# EAGLE design mainboard (EAGLE 6.5.0)
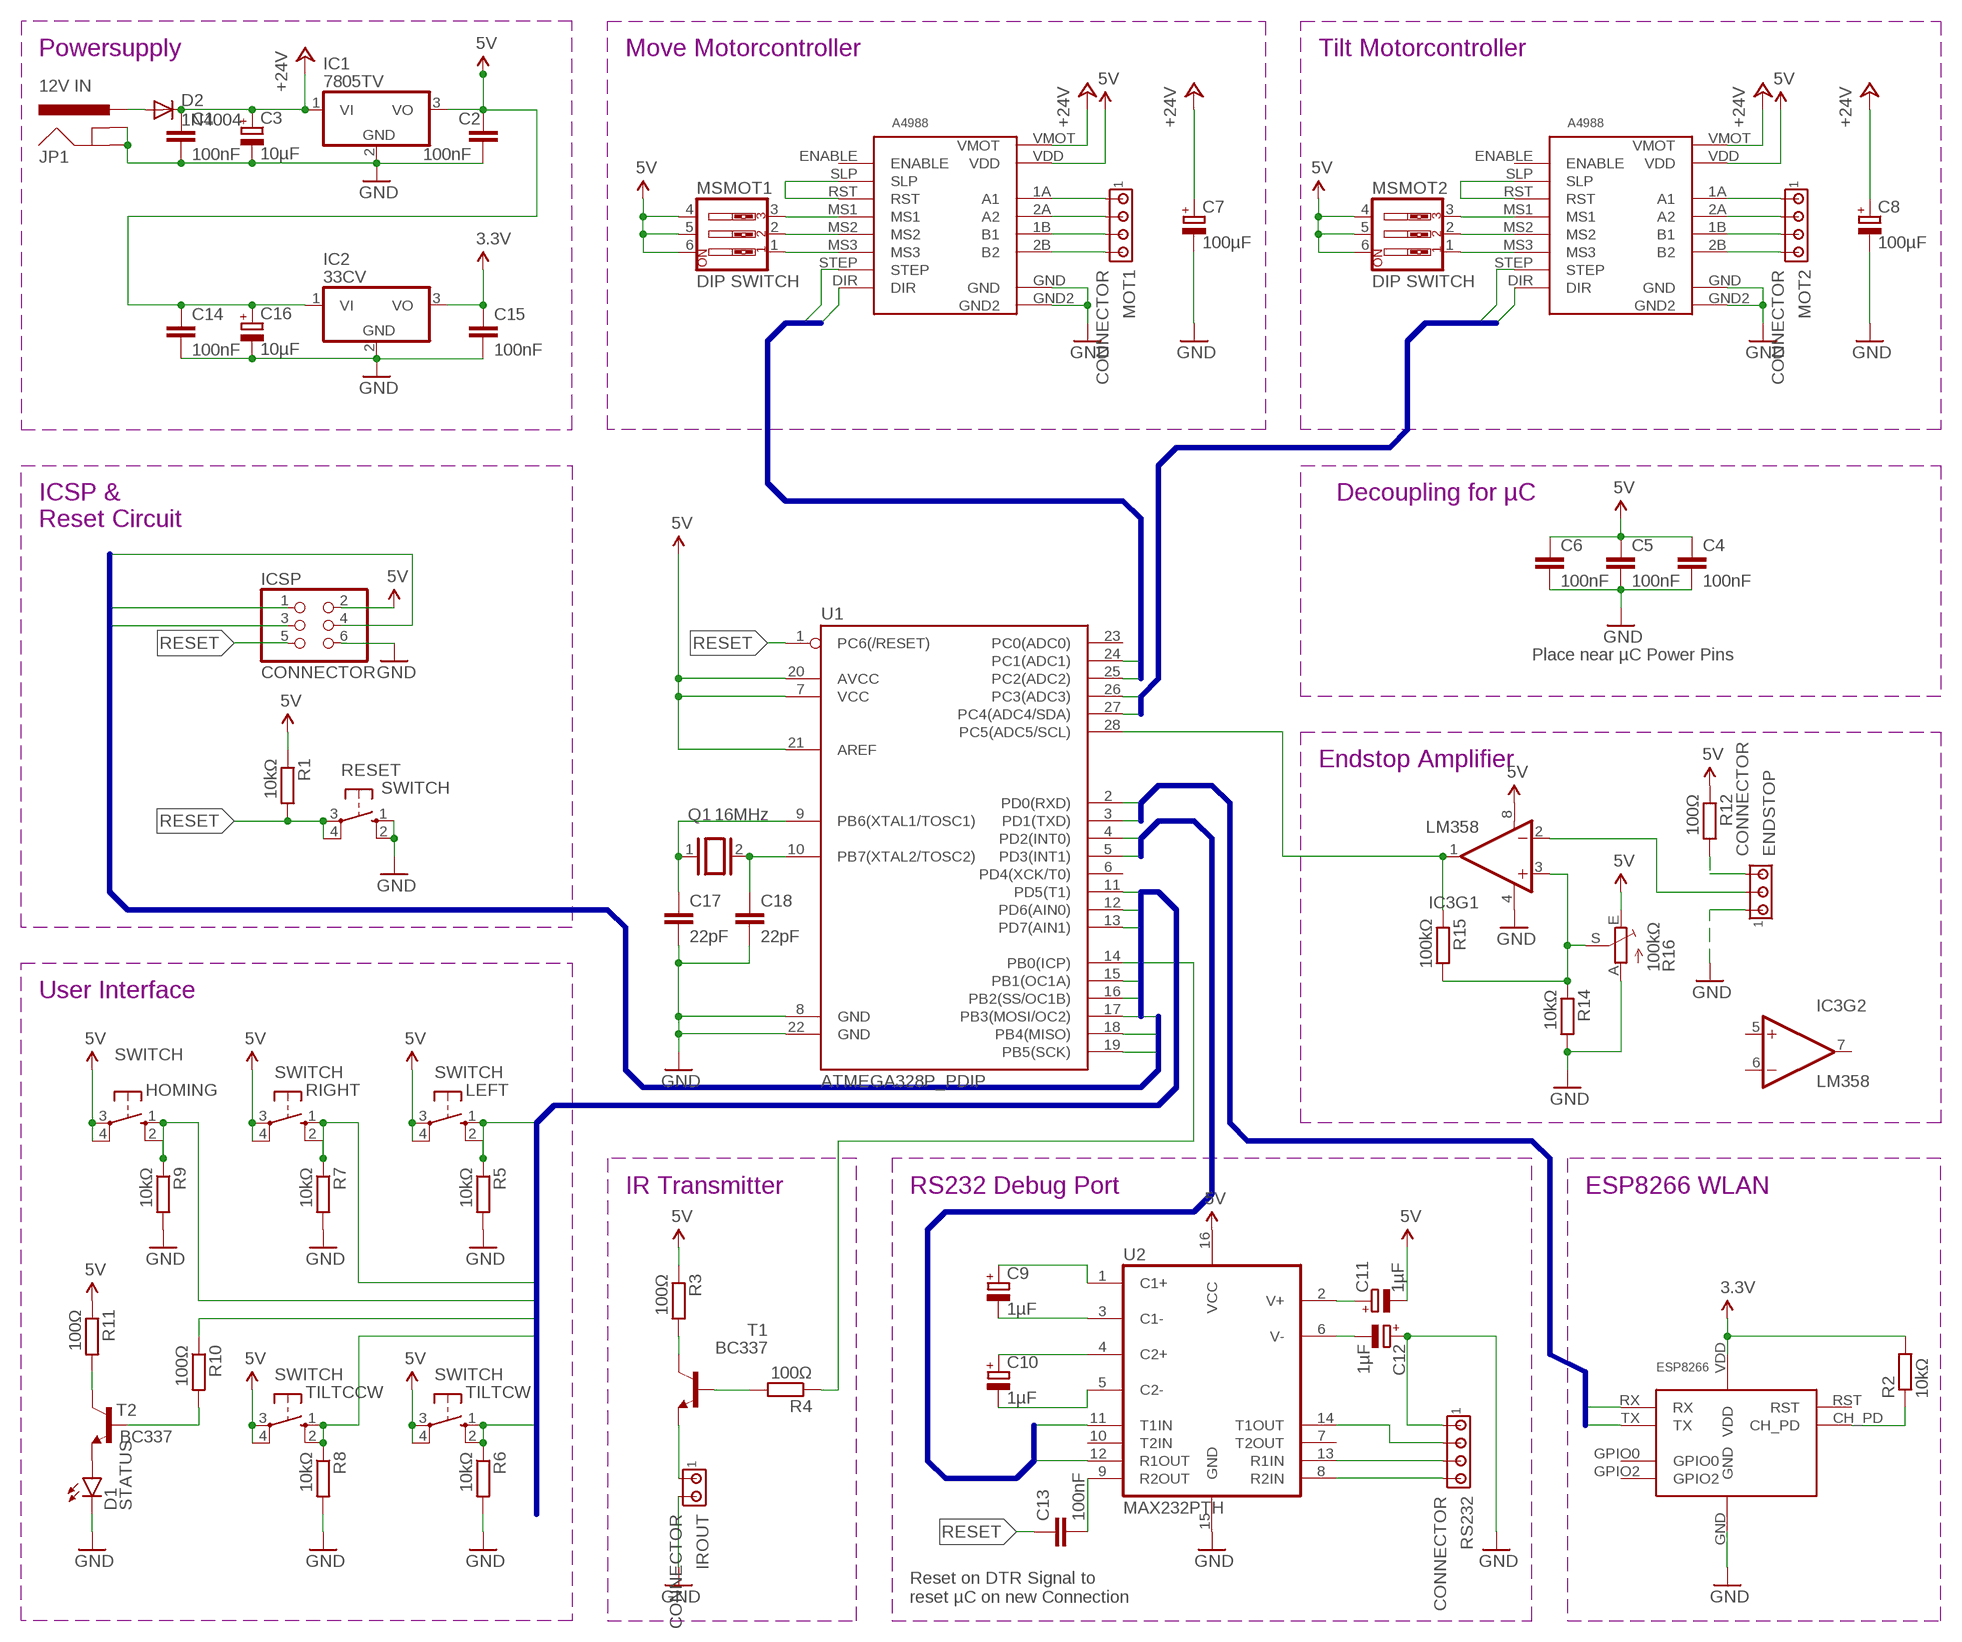
[diagram p0: schematic, sheet 1]

## Parts
C1  100nF  C-EU050-024X044  [C050-024X044]
C2  100nF  C-EU050-024X044  [C050-024X044]
C3  10µF  CPOL-EUE2,5-6E  [E2,5-6E]
C4  100nF  C-EU050-024X044  [C050-024X044]
C5  100nF  C-EU050-024X044  [C050-024X044]
C6  100nF  C-EU050-024X044  [C050-024X044]
C7  100µF  CPOL-EUE2,5-6E  [E2,5-6E]
C8  100µF  CPOL-EUE2,5-6E  [E2,5-6E]
C9  1µF  CPOL-EUE2,5-6E  [E2,5-6E]
C10  1µF  CPOL-EUE2,5-6E  [E2,5-6E]
C11  1µF  CPOL-EUE2,5-6E  [E2,5-6E]
C12  1µF  CPOL-EUE2,5-6E  [E2,5-6E]
C13  100nF  C-EU050-024X044  [C050-024X044]
C14  100nF  C-EU050-024X044  [C050-024X044]
C15  100nF  C-EU050-024X044  [C050-024X044]
C16  10µF  CPOL-EUE2,5-6E  [E2,5-6E]
C17  22pF  C-EU050-024X044  [C050-024X044]
C18  22pF  C-EU050-024X044  [C050-024X044]
D1  STATUS  LED5MM  [LED5MM]
D2  1N4004  [DO41-10]
ENDSTOP  CONNECTOR  MTA03-100  [10X03MTA]
HOMING  SWITCH  10-XX  [B3F-10XX]
IC1  7805TV  [TO220V]
IC2  33CV  7805TV  [TO220V]
IC3  LM358  [DIP08]
ICSP  CONNECTOR  PINHD-2X3  [2X03]
IROUT  CONNECTOR  MTA02-100  [10X02MTA]
JP1  12V IN  POWER_JACKSLT  [POWER_JACK_SLOT]
LEFT  SWITCH  10-XX  [B3F-10XX]
MOT1  CONNECTOR  MTA04-100  [10X04MTA]
MOT2  CONNECTOR  MTA04-100  [10X04MTA]
MSMOT1  DIP SWITCH  SW_DIP-3  [EDG-03]
MSMOT2  DIP SWITCH  SW_DIP-3  [EDG-03]
Q1  16MHz  XTAL/S  [QS]
R1  10kΩ  R-EU_0207/7  [0207/7]
R2  10kΩ  R-EU_0207/7  [0207/7]
R3  100Ω  R-EU_0207/7  [0207/7]
R4  100Ω  R-EU_0207/7  [0207/7]
R5  10kΩ  R-EU_0207/7  [0207/7]
R6  10kΩ  R-EU_0207/7  [0207/7]
R7  10kΩ  R-EU_0207/7  [0207/7]
R8  10kΩ  R-EU_0207/7  [0207/7]
R9  10kΩ  R-EU_0207/7  [0207/7]
R10  100Ω  R-EU_0207/7  [0207/7]
R11  100Ω  R-EU_0207/7  [0207/7]
R12  100Ω  R-EU_0207/7  [0207/7]
R14  10kΩ  R-EU_0207/7  [0207/7]
R15  100kΩ  R-EU_0207/7  [0207/7]
R16  100kΩ  TRIM_EU-CA9V  [CA9V]
RESET  SWITCH  10-XX  [B3F-10XX]
RIGHT  SWITCH  10-XX  [B3F-10XX]
RS232  CONNECTOR  MTA04-100  [10X04MTA]
T1  BC337  [TO92]
T2  BC337  [TO92]
TILTCCW  SWITCH  10-XX  [B3F-10XX]
TILTCW  SWITCH  10-XX  [B3F-10XX]
U1  ATMEGA328P_PDIP  [DIL28-3]
U2  MAX232PTH  [DIL16]
U3  A4988  [A4988]
U4  A4988  [A4988]
U5  ESP8266  [ESP8266]

## Nets
3.3V: C15.1 IC2.3(VO) R2.2 U5.VDD
5V: C2.1 C4.1 C5.1 C6.1 C11.- C14.1 C16.+ HOMING.3(P) HOMING.4(P1) IC1.3(VO) IC2.1(VI) IC3.8(V+) ICSP.2 LEFT.3(P) LEFT.4(P1) MSMOT1.4 MSMOT1.5 MSMOT1.6 MSMOT2.4 MSMOT2.5 MSMOT2.6 R1.1 R3.1 R11.1 R12.1 R16.E RIGHT.3(P) RIGHT.4(P1) TILTCCW.3(P) TILTCCW.4(P1) TILTCW.3(P) TILTCW.4(P1) U1.7(VCC) U1.20(AVCC) U1.21(AREF) U2.16(VCC) U3.VDD U4.VDD
+24V: C1.1 C3.+ C7.+ C8.+ D2.C IC1.1(VI) U3.VMOT U4.VMOT
DIR1: U1.24(PC1(ADC1)) U3.DIR
DIR2: U1.26(PC3(ADC3)) U4.DIR
ESPRX: U1.3(PD1(TXD)) U5.RX
ESPTX: U1.2(PD0(RXD)) U5.TX
GND: C1.2 C2.2 C3.- C4.2 C5.2 C6.2 C7.- C8.- C12.+ C14.2 C15.2 C16.- C17.2 C18.2 D1.K(C) ENDSTOP.1 IC1.2(GND) IC2.2(GND) IC3.4(V-) ICSP.6 IROUT.2 JP1.GND@1(GNDBREAK) JP1.GND@2(GND) R5.2 R6.2 R7.2 R8.2 R9.2 R14.2 R16.A RESET.1(S) RESET.2(S1) RS232.1 U1.8(GND) U1.22(GND) U2.15(GND) U3.GND U3.GND2 U4.GND U4.GND2 U5.GND
HOMING: HOMING.1(S) HOMING.2(S1) ICSP.4 R9.1 U1.17(PB3(MOSI/OC2))
LEFT: LEFT.1(S) LEFT.2(S1) R5.1 U1.11(PD5(T1))
MISO: ICSP.1 U1.18(PB4(MISO))
N$1: U3.RST U3.SLP
N$2: MOT1.1 U3.1A(A1)
N$3: MOT1.2 U3.2A(A2)
N$4: MOT1.3 U3.1B(B1)
N$5: MOT1.4 U3.2B(B2)
N$6: MSMOT1.1 U3.MS3
N$7: MSMOT1.2 U3.MS2
N$8: MSMOT1.3 U3.MS1
N$9: U4.RST U4.SLP
N$10: C13.2 U2.9(R2OUT)
N$11: MSMOT2.1 U4.MS3
N$12: MSMOT2.2 U4.MS2
N$13: MSMOT2.3 U4.MS1
N$14: MOT2.1 U4.1A(A1)
N$15: MOT2.2 U4.2A(A2)
N$16: MOT2.3 U4.1B(B1)
N$17: MOT2.4 U4.2B(B2)
N$18: RS232.2 U2.14(T1OUT)
N$19: RS232.3 U2.13(R1IN)
N$20: C9.+ U2.1(C1+)
N$21: C9.- U2.3(C1-)
N$22: C10.+ U2.4(C2+)
N$23: C10.- U2.5(C2-)
N$24: C11.+ U2.2(V+)
N$25: C12.- U2.6(V-)
N$26: RS232.4 U2.8(R2IN)
N$27: R2.1 U5.CH_PD
N$28: R4.2 T1.2(B)
N$29: R3.2 T1.3(C)
N$30: IROUT.1 T1.1(E)
N$31: IC3.1(OUT) R15.1 U1.28(PC5(ADC5/SCL))
N$32: D1.A T2.1(E)
N$33: R10.2 T2.2(B)
N$34: R11.2 T2.3(C)
N$35: ENDSTOP.3 R12.2
N$36: ENDSTOP.2 IC3.2(-IN)
N$37: IC3.3(+IN) R14.1 R15.2 R16.S
N$38: R4.1 U1.14(PB0(ICP))
N$39: C18.1 Q1.2 U1.10(PB7(XTAL2/TOSC2))
N$40: C17.1 Q1.1 U1.9(PB6(XTAL1/TOSC1))
N$41: D2.A JP1.PWR
RESET: C13.1 ICSP.5 R1.2 RESET.3(P) RESET.4(P1) U1.1(PC6(/RESET))
RIGHT: R7.1 RIGHT.1(S) RIGHT.2(S1) U1.13(PD7(AIN1))
RXD: U1.4(PD2(INT0)) U2.12(R1OUT)
SCK: ICSP.3 U1.19(PB5(SCK))
STATUS: R10.1 U1.16(PB2(SS/OC1B))
STEP1: U1.25(PC2(ADC2)) U3.STEP
STEP2: U1.27(PC4(ADC4/SDA)) U4.STEP
TILTCCW: R8.1 TILTCCW.1(S) TILTCCW.2(S1) U1.12(PD6(AIN0))
TILTCW: R6.1 TILTCW.1(S) TILTCW.2(S1) U1.15(PB1(OC1A))
TXD: U1.5(PD3(INT1)) U2.11(T1IN)
Unconnected: IC3.5(+IN) IC3.6(-IN) IC3.7(OUT) U1.6(PD4(XCK/T0)) U1.23(PC0(ADC0)) U2.7(T2OUT) U2.10(T2IN) U3.ENABLE U4.ENABLE U5.GPIO0 U5.GPIO2 U5.RST

## Buses
STEP2,DIR2
RXD,TXD
HOMING,MISO,SCK
ESPTX,ESPRX
LEFT,RIGHT,TILTCW,TILTCCW,HOMING,STATUS
STEP1,DIR1

## Notes on the sheet
- Powersupply | Move Motorcontroller | Tilt Motorcontroller
- ICSP &
  Reset Circuit
- Decoupling for µC
- Place near µC Power Pins
- Endstop Amplifier
- User Interface
- IR Transmitter | RS232 Debug Port | ESP8266 WLAN
- Reset on DTR Signal to 
  reset µC on new Connection

## Library data of the parts
C1 C2 C4-C6 C13-C15 C17 C18 = rcl:C-EU: CAPACITOR, European symbol
C3 C7-C12 C16 = rcl:CPOL-EU: POLARIZED CAPACITOR, European symbol
D1 = SparkFun-LED:LED: LEDs Standard schematic elements and footprints for 5mm, 3mm, 1206, and 0603 sized LEDs. 5mm - Spark Fun Electronics SKU : COM-00529 (and others)
D2 = diode:1N4004: DIODE general purpose rectifier, 1 A
ENDSTOP = con-amp:MTA03-100: AMP connector
HOMING LEFT RESET RIGHT TILTCCW TILTCW = switch-omron:10-XX: OMRON SWITCH; MPN: B3F-1000; OC_FARNELL: 176432; OC_NEWARK: 36M3542
IC1 IC2 = linear:78*: Positive VOLTAGE REGULATOR Source: http://cache.national.com/ds/LM/LM78L05.pdf http://www.fairchildsemi.com/ds/LM/LM7805.pdf
IC3 = SparkFun-AnalogIC:LM358: Jellybean op-amp; PROD_ID: IC-09172
ICSP = SparkFun-Connectors:PINHD-2X3: PIN HEADER
IROUT = con-amp:MTA02-100: AMP connector
JP1 = SparkFun-Connectors:POWER_JACK: Power Jack This is the standard 5.5mm barrel jack for power. The PTH is the most common, proven, reliable, footprint. The Slot footprint only works if the mill layer is transmitted to the PCB fab house so be warned. Mating wall wart : TOL-00298 (and others); PROD_ID: PRT-00119
MOT1 MOT2 RS232 = con-amp:MTA04-100: AMP connector
MSMOT1 MSMOT2 = special:SW_DIP-3: DIP SWITCH
Q1 = special:XTAL/S: CRYSTAL
R1-R12 R14 R15 = rcl:R-EU_: RESISTOR, European symbol
R16 = pot:TRIM_EU-: POTENTIOMETER
T1 T2 = transistor:BC337: NPN TRANSISTOR
U1 = SparkFun-DigitalIC:ATMEGA328P_PDIP: uC used in the Arduino 32kb flash, 1k EEPROM, 2k SRAM This is the through-hole version of this chip.
U2 = SparkFun-DigitalIC:MAX232: RS232 Transceiver Very common IC. This is generically called 'MAX232', but works with the 3V equivalent MAX3232 generic ICs. Field tested and mother approved. Spark Fun Electronics SKU : COM-00316 (DIP) and COM-00589 (SMD)
U3 U4 = parts:A4988
U5 = parts:ESP8266

## Board
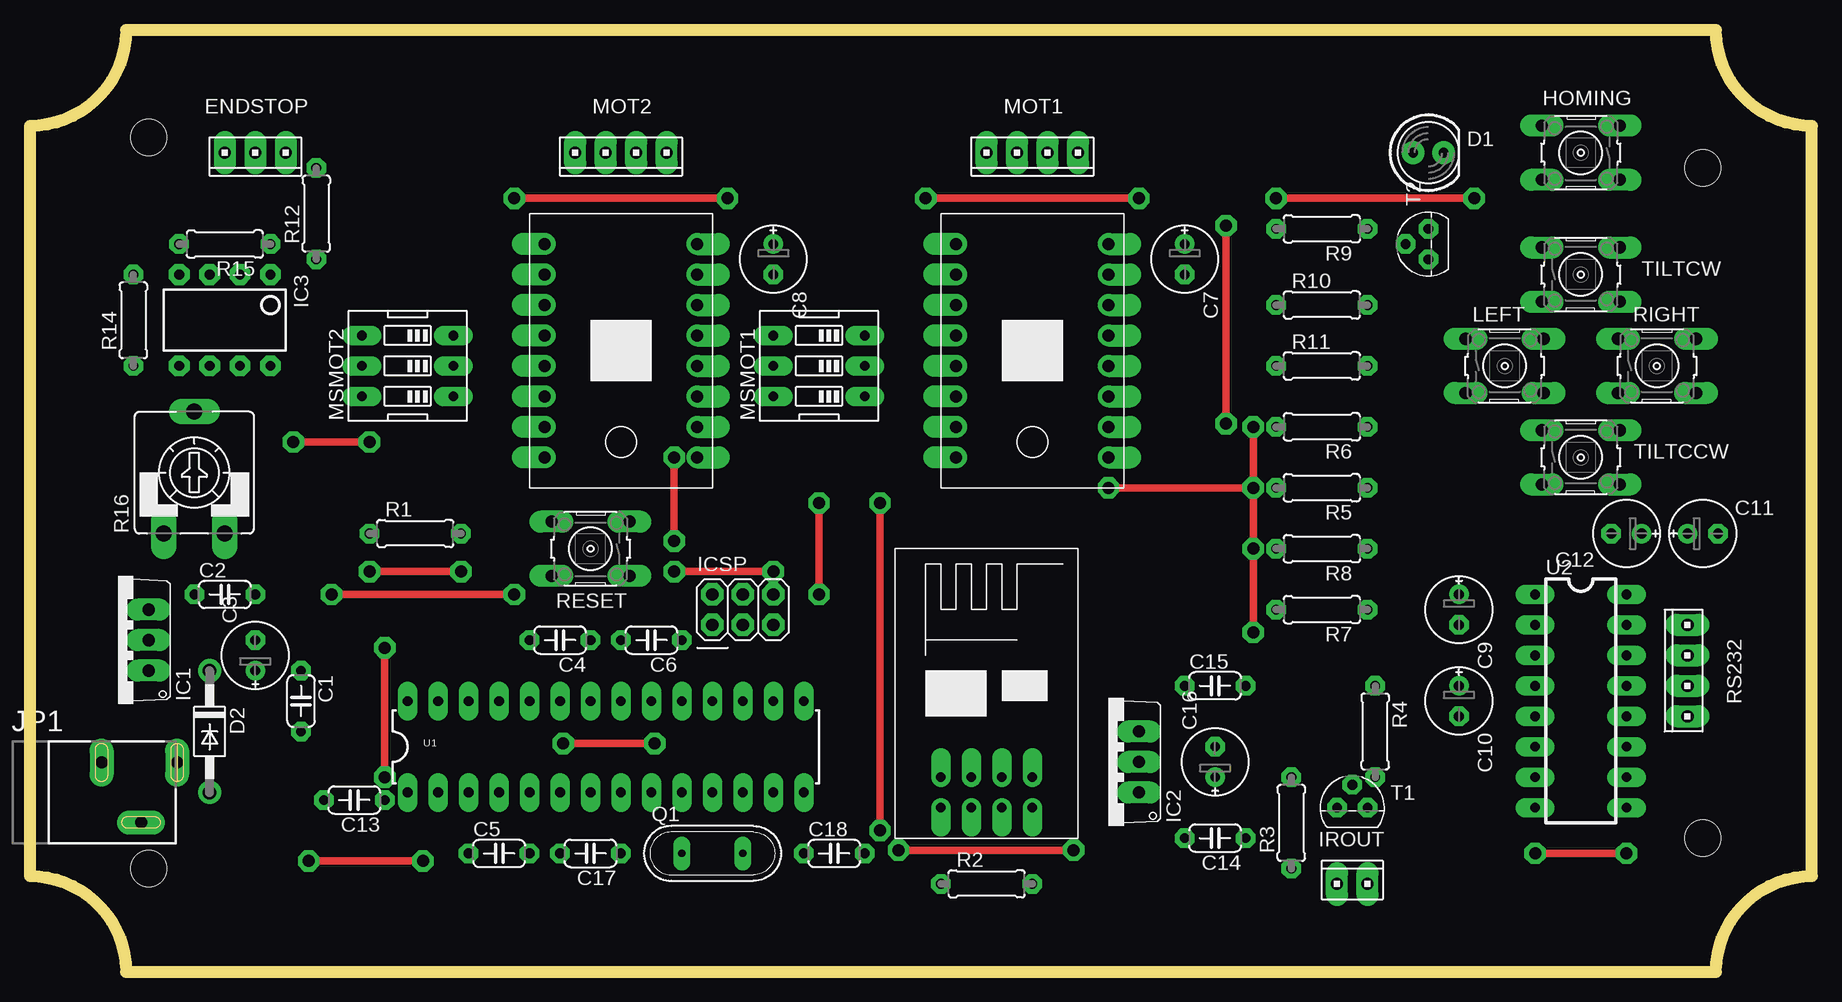
[diagram p1: board, top side]
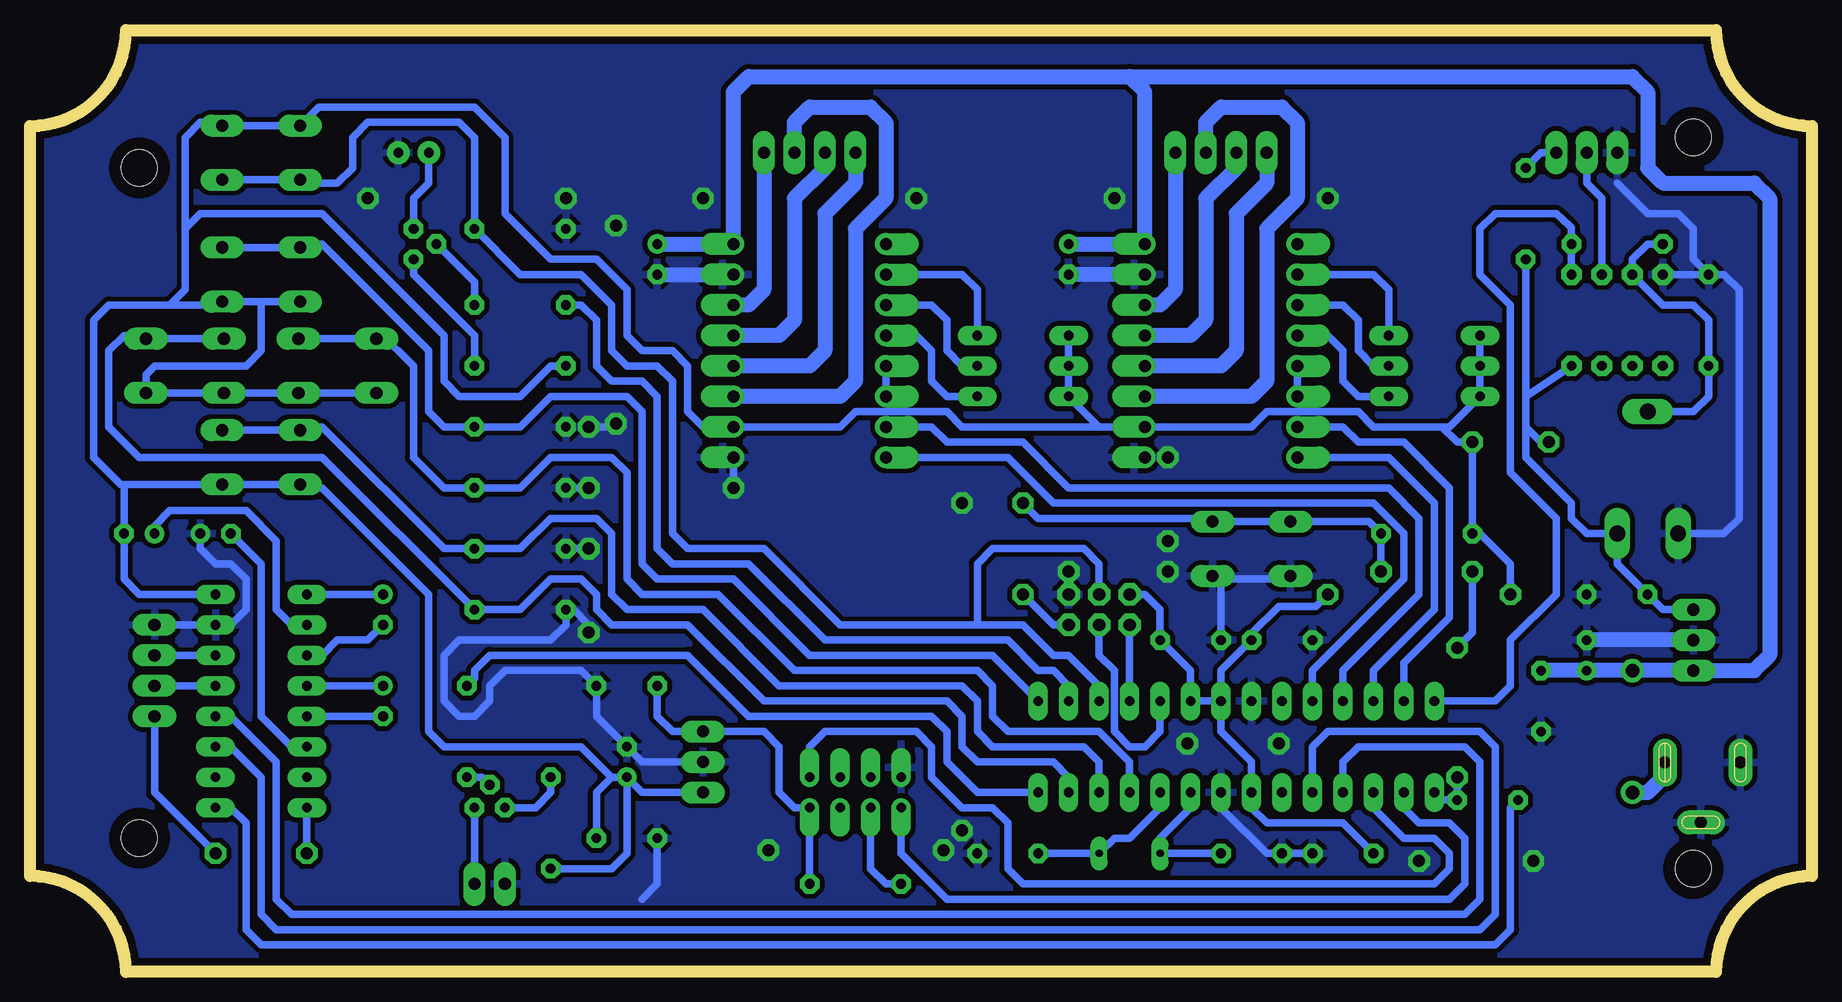
[diagram p2: board, bottom side, seen from below]

Size 148.54 x 78.54 mm. Coordinates in mm from the lower left corner, seen from the top.
Outline: 148.54,70.54 arc-90 140.54,78.54 8,78.54 arc-90 0,70.54 0,8 arc-90 8,0 140.54,0 arc-90 148.54,8 148.54,70.54
Copper layers (1*16): Top 0.035mm / dielectric 1.5mm / Bottom 0.035mm
Design rules "default *": minimum track width 10mil, minimum drill 24mil, track to track 8mil, track to pad 8mil, pad to pad 8mil, via to via 8mil, smd to smd 8mil, copper to edge 40mil, drill to drill 8mil, minimum pad ring 16mil, minimum via ring 8mil, stop-mask expansion 4mil, vias tented up to drill 0mil, thermal gap 16mil
Holes 3 mm at 139.43,67.04 139.43,11.16 9.89,8.62 9.89,69.58
Milling: 8 lines

### Footprints (pad centres in the part's own frame; a part is rotated, then mirrored left to right if it is on the bottom)
C050-024X044 = drill 0.813 octagon: 1 -2.54,0; 2 2.54,0
E2,5-6E = drill 0.813 pad 1.575: + -1.27,0 | drill 0.813 pad 1.575 octagon: - 1.27,0
LED5MM = drill 0.813 pad 1.88: A -1.27,0; K 1.27,0
DO41-10 = drill 1.118: A 5.08,0; C -5.08,0
10X03MTA = drill 1.016 long: 1 2.54,0; 2 0,0; 3 -2.54,0
B3F-10XX = drill 1.016 long: 1 -3.251,2.261; 2 3.251,2.261; 3 -3.251,-2.261; 4 3.251,-2.261
TO220V = drill 1.016 long: 1 -2.54,-2.54; 2 0,-2.54; 3 2.54,-2.54
DIP08 = drill 0.813 pad 1.727 octagon: 1 -3.81,-3.81; 2 -1.27,-3.81; 3 1.27,-3.81; 4 3.81,-3.81; 5 3.81,3.81; 6 1.27,3.81; 7 -1.27,3.81; 8 -3.81,3.81
2X03 = drill 1.016 pad 1.88 octagon: 1 -2.54,-1.27; 2 -2.54,1.27; 3 0,-1.27; 4 0,1.27; 5 2.54,-1.27; 6 2.54,1.27
10X02MTA = drill 1.016 long: 1 1.27,0; 2 -1.27,0
POWER_JACK_SLOT = drill 1 pad 2 long: GND@1 2.58,7.5; GND@2 7.58,10.8; PWR 2.58,13.8
10X04MTA = drill 1.016 long: 1 3.81,0; 2 1.27,0; 3 -1.27,0; 4 -3.81,0
EDG-03 = drill 0.813 long: 1 -2.54,-3.81; 2 0,-3.81; 3 2.54,-3.81; 4 2.54,3.81; 5 0,3.81; 6 -2.54,3.81
QS = drill 0.61 long: 1 -2.54,0; 2 2.54,0
0207/7 = drill 0.813 octagon: 1 -3.81,0; 2 3.81,0
CA9V = drill 1.321 long: A -2.54,-5.08; E 2.54,-5.08; S 0,5.08
TO92 = drill 0.813 octagon: 1 1.27,0; 2 0,1.905; 3 -1.27,0
DIL28-3 = drill 0.813 long: 1 -16.51,-3.81; 2 -13.97,-3.81; 3 -11.43,-3.81; 4 -8.89,-3.81; 5 -6.35,-3.81; 6 -3.81,-3.81; 7 -1.27,-3.81; 8 1.27,-3.81; 9 3.81,-3.81; 10 6.35,-3.81; 11 8.89,-3.81; 12 11.43,-3.81; 13 13.97,-3.81; 14 16.51,-3.81; 15 16.51,3.81; 16 13.97,3.81; 17 11.43,3.81; 18 8.89,3.81; 19 6.35,3.81; 20 3.81,3.81; 21 1.27,3.81; 22 -1.27,3.81; 23 -3.81,3.81; 24 -6.35,3.81; 25 -8.89,3.81; 26 -11.43,3.81; 27 -13.97,3.81; 28 -16.51,3.81
DIL16 = drill 0.813 long: 1 -8.89,-3.81; 2 -6.35,-3.81; 3 -3.81,-3.81; 4 -1.27,-3.81; 5 1.27,-3.81; 6 3.81,-3.81; 7 6.35,-3.81; 8 8.89,-3.81; 9 8.89,3.81; 10 6.35,3.81; 11 3.81,3.81; 12 1.27,3.81; 13 -1.27,3.81; 14 -3.81,3.81; 15 -6.35,3.81; 16 -8.89,3.81
A4988 = drill 1 offset: 1A 6.35,-1.27; 1B 6.35,-3.81; 2A 6.35,1.27; 2B 6.35,3.81; DIR -6.35,-8.89; ENABLE -6.35,8.89; GND 6.35,6.35; GND2 6.35,-8.89; MS1 -6.35,6.35; MS2 -6.35,3.81; MS3 -6.35,1.27; RST -6.35,-1.27; SLP -6.35,-3.81; STEP -6.35,-6.35; VDD 6.35,-6.35; VMOT 6.35,8.89
ESP8266 = drill 0.8 offset: CH_PD -1.27,-3.81; GND -3.81,-1.27; GPIO0 1.27,-1.27; GPIO2 -1.27,-1.27; RST 1.27,-3.81; RX 3.81,-1.27; TX -3.81,-3.81; VDD 3.81,-3.81

### Placement (x,y rotation side)
C1  22.59,22.59 270 top
C2  16.24,31.48 0 top
C3  18.78,26.4 90 top
C4  44.18,27.67 180 top
C5  39.1,9.89 0 top
C6  51.8,27.67 180 top
C7  96.25,59.42 270 top
C8  61.96,59.42 270 top
C9  119.11,30.21 270 top
C10  119.11,22.59 270 top
C11  139.43,36.56 0 top
C12  133.08,36.56 180 top
C13  27.04,14.33 180 top
C14  98.79,11.16 180 top
C15  98.79,23.86 0 top
C16  98.79,17.51 90 top
C17  46.72,9.89 180 top
C18  67.04,9.89 0 top
D1  116.57,68.31 0 top
D2  14.97,20.05 270 top
ENDSTOP  18.78,68.31 180 top
HOMING  129.27,68.31 180 top
IC1  7.35,27.67 90 top
IC2  89.9,17.51 90 top
IC3  16.24,54.34 180 top
ICSP  59.42,30.21 0 top
IROUT  110.22,7.35 0 top
JP1  -1.54,20.05 270 top
LEFT  122.92,50.53 0 top
MOT1  83.55,68.31 180 top
MOT2  49.26,68.31 180 top
MSMOT1  65.77,50.53 90 top
MSMOT2  31.48,50.53 90 top
Q1  56.88,9.89 0 top
R1  32.12,36.56 0 top
R2  79.74,7.35 0 top
R3  105.14,12.43 90 top
R4  112.12,20.05 270 top
R5  107.68,40.37 180 top
R6  107.68,45.45 180 top
R7  107.68,30.21 180 top
R8  107.68,35.29 180 top
R9  107.68,61.96 180 top
R10  107.68,55.61 0 top
R11  107.68,50.53 0 top
R12  23.86,63.23 90 top
R14  8.62,54.34 90 top
R15  16.24,60.69 180 top
R16  13.7,41.64 0 top
RESET  46.72,35.29 180 top
RIGHT  135.62,50.53 0 top
RS232  138.16,25.13 90 top
T1  110.22,13.7 0 top
T2  116.57,60.69 90 top
TILTCCW  129.27,42.91 0 top
TILTCW  129.27,58.15 0 top
U1  47.99,18.78 0 top
U2  129.27,22.59 270 top
U3  83.55,51.8 0 top
U4  49.26,51.8 0 top
U5  79.74,17.51 0 top

### Tracks (layer width: path | path; a pad name or v marks a point on that pad's centre or on a via)
3.3V
  Bottom 0.61: R2.2 U5.VDD 84.82,13.7 86.09,14.97 86.09,18.78 87.36,20.05 IC2.3 94.98,20.05 96.25,21.32 C15.1
5V  (via drill 1 pad 1.78)
  Top 0.61: v40.37,31.48 v25.13,31.48 | v28.3,44.18 v21.95,44.18
  Bottom 0.61: C16.+ 97.52,14.97 IC2.1 | U1.21 U1.20 51.8,25.13 C6.1 54.34,30.21 55.61,31.48 ICSP.2 | U2.16 139.43,31.48 140.7,32.75 C11.- 140.7,40.65 | R12.1 23.86,47.99 | 23.86,45.45 23.86,42.91 20.05,39.1 20.05,37.83 18.78,36.56 R16.E 16.24,34.02 C2.1 12.43,30.21 IC1.3 | 23.86,45.45 23.86,47.99 | 23.86,47.99 IC3.8 | TILTCW.3 129.27,55.89 | 129.27,55.89 TILTCW.4 132.8,55.61 136.89,55.61 | LEFT.3 LEFT.4 RIGHT.3 RIGHT.4 138.87,49.82 138.16,50.53 130.54,50.53 129.27,51.8 129.27,55.89 | 140.7,40.65 TILTCCW.4 TILTCCW.3 125.74,40.37 124.19,40.37 115.3,31.48 115.3,20.05 114.03,18.78 102.6,18.78 100.06,16.24 | 140.7,40.65 140.98,40.65 143.24,42.91 143.24,54.34 141.97,55.61 136.89,55.61 | 136.89,55.61 135.62,56.88 135.62,61.96 | C16.+ 98.79,9.89 100.06,8.62 R3.1 | C14.1 101.33,14.97 100.06,16.24 | 100.06,16.24 C16.+ | R11.1 105.14,50.53 107.68,47.99 112.76,47.99 114.03,49.26 114.03,53.07 124.19,63.23 134.35,63.23 135.62,61.96 | C5.1 39.1,12.43 45.45,12.43 46.72,13.7 U1.7 46.72,17.51 49.26,20.05 U1.21 | 59.42,45.45 U4.VDD 46.72,45.45 45.45,46.72 37.83,46.72 36.56,45.45 30.84,45.45 | U1.21 49.26,25.13 C4.1 46.72,28.21 44.45,30.48 41.37,30.48 v40.37,31.48 | MSMOT2.4 MSMOT2.5 MSMOT2.6 30.21,45.45 30.84,45.45 | 59.42,45.45 70.85,45.45 72.12,46.72 79.74,46.72 81.01,45.45 U3.VDD 92.44,45.45 93.71,46.72 93.71,50.53 94.98,51.8 97.52,51.8 98.79,53.07 98.79,56.88 101.33,59.42 105.14,59.42 108.95,63.23 108.95,69.58 111.49,72.12 124.47,72.12 HOMING.4 HOMING.3 132.8,70.85 134.35,70.85 135.62,69.58 135.62,61.96 | 59.42,45.45 MSMOT1.6 MSMOT1.5 MSMOT1.4 | v25.13,31.48 25.13,34.02 27.67,36.56 R1.1 v28.3,44.18 29.57,44.18 30.84,45.45
  Bottom 0.61: v21.95,44.18 22.59,44.18 23.86,45.45
+24V
  Bottom 1.27: C7.+ U3.VMOT 89.9,73.39 88.63,74.66 56.88,74.66 | C8.+ U4.VMOT 55.61,73.39 56.88,74.66 | 56.88,74.66 14.97,74.66 13.7,73.39 13.7,67.04 12.43,65.77 4.81,65.77 3.54,64.5 3.54,26.4 4.81,25.13 IC1.1 D2.C C3.+ C1.1
DIR1
  Bottom 0.61: U1.24 41.64,25.13 34.02,32.75 34.02,36.56 36.56,39.1 63.23,39.1 67.04,42.91 U3.DIR
DIR2
  Bottom 0.61: U1.26 36.56,25.13 31.48,30.21 31.48,39.1 35.29,42.91 U4.DIR
ESPRX
  Bottom 0.61: U5.RX 83.55,18.78 82.28,20.05 74.66,20.05 73.39,18.78 73.39,16.24 70.85,13.7 68.31,13.7 67.04,12.43 67.04,8.62 65.77,7.35 31.48,7.35 30.21,8.62 30.21,9.89 31.48,11.16 34.02,11.16 36.56,13.7 U1.3
ESPTX
  Bottom 0.61: U5.TX 75.93,9.89 72.12,6.08 30.21,6.08 28.94,7.35 28.94,11.16 30.21,12.43 32.75,12.43 34.02,13.7 U1.2
GND  (via drill 1 pad 1.78)
  Top 0.61: v101.96,40.37 v101.96,35.29 v101.96,28.3 | v101.96,45.45 v101.96,40.37 | v101.96,40.37 v89.9,40.37 | v99.69,45.72 v99.69,62.23 | v72.39,10.16 v86.99,10.16 | v44.45,19.05 v52.07,19.05 | v40.37,64.5 v58.15,64.5 | v23.22,9.26 v32.75,9.26 | v53.71,35.93 v53.71,42.91 | v53.71,33.38 v61.96,33.38 | v74.66,64.5 v92.44,64.5 | v103.87,64.5 v120.38,64.5 | v70.85,11.79 v70.85,39.1
  Bottom 0.61: RS232.1 U2.15 131.81,28.94 130.54,30.21 130.54,32.75 131.81,34.02 133.08,34.02 134.35,35.29 C12.+ | IC2.2 97.52,17.51 C16.- 101.33,21.32 C15.2 102.6,25.13 108.95,25.13 110.22,23.86 110.22,22.59 111.49,21.32 112.76,21.32 114.03,22.59 114.03,26.4 112.76,27.67 105.14,27.67 103.87,28.94 R7.2 103.23,30.21 101.96,28.94 | C14.2 96.25,7.35 97.52,6.08 | R14.2 7.35,58.15 6.08,56.88 6.08,37.83 7.35,36.56 R16.A | R14.2 IC3.4 | 16.24,65.77 13.7,63.23 11.16,63.23 9.89,61.96 9.89,59.42 R14.2 | U1.8 49.26,13.7 45.45,9.89 C17.2 C5.2 | 42.91,32.75 43.19,32.75 | 43.19,32.75 RESET.2 | RESET.1 49.26,32.32 C6.2 49.26,32.75 43.19,32.75 | 46.72,23.86 U1.22 46.72,21.32 | R5.2 v101.96,40.37 | R8.2 v101.96,35.29 | v89.9,40.37 U3.GND2 | 118.11,68.58 D1.K | v101.96,45.45 100.6,45.45 v99.69,45.72 | v99.69,62.23 99.06,62.23
  Bottom 1.27: IC1.2 C3.- | C7.- U3.GND | U4.GND C8.-
  pour Bottom (isolate 0.406): 1.27,1.27 147.27,1.27 147.27,77.27 1.27,77.27
HOMING
  Bottom 0.61: 69.58,28.94 81.01,28.94 87.36,35.29 93.71,35.29 94.98,36.56 94.98,49.26 96.25,50.53 98.79,50.53 100.06,51.8 100.06,55.61 102.6,58.15 107.68,58.15 R9.1 111.49,69.58 112.76,70.85 120.38,70.85 121.65,69.58 121.65,67.04 122.92,65.77 125.74,65.77 HOMING.2 HOMING.1 | 69.58,28.94 65.77,28.94 63.23,26.4 61.96,26.4 59.42,23.86 U1.17 | ICSP.4 59.42,34.02 60.69,35.29 68.31,35.29 69.58,34.02 69.58,28.94
LEFT
  Bottom 0.61: LEFT.2 LEFT.1 119.39,53.07 117.84,51.8 116.57,50.53 116.57,42.91 114.03,40.37 R5.1 107.68,40.37 105.14,42.91 100.06,42.91 98.79,41.64 98.79,32.75 97.52,31.48 91.17,31.48 84.82,25.13 69.58,25.13 68.31,23.86 68.31,21.32 67.04,20.05 59.42,20.05 56.88,17.51 U1.11
MISO
  Bottom 0.61: U1.18 ICSP.1
N$1
  Bottom 0.61: U3.RST U3.SLP
N$2
  Bottom 1.27: MOT1.1 79.74,65.77 82.28,63.23 82.28,51.8 83.55,50.53 U3.1A
N$3
  Bottom 1.27: MOT1.2 82.28,67.04 84.82,64.5 84.82,54.34 86.09,53.07 U3.2A
N$4
  Bottom 1.27: MOT1.3 84.82,70.85 83.55,72.12 78.47,72.12 77.2,70.85 77.2,64.5 79.74,61.96 79.74,49.26 81.01,47.99 U3.1B
N$5
  Bottom 1.27: MOT1.4 87.36,56.88 88.63,55.61 U3.2B
N$6
  Bottom 0.61: MSMOT1.1 72.12,47.99 73.39,49.26 73.39,51.8 74.66,53.07 U3.MS3
N$7
  Bottom 0.61: MSMOT1.2 70.85,50.53 72.12,51.8 72.12,54.34 73.39,55.61 U3.MS2
N$8
  Bottom 0.61: MSMOT1.3 69.58,56.88 70.85,58.15 U3.MS1
N$9
  Bottom 0.61: U4.RST U4.SLP
N$10
  Bottom 0.61: U2.9 131.81,13.7 130.54,12.43 130.54,3.54 129.27,2.27 26.4,2.27 25.13,3.54 25.13,13.7 C13.2
N$11
  Bottom 0.61: MSMOT2.1 37.83,47.99 39.1,49.26 39.1,51.8 40.37,53.07 U4.MS3
N$12
  Bottom 0.61: MSMOT2.2 36.56,50.53 37.83,51.8 37.83,54.34 39.1,55.61 U4.MS2
N$13
  Bottom 0.61: MSMOT2.3 35.29,56.88 36.56,58.15 U4.MS1
N$14
  Bottom 1.27: MOT2.1 45.45,65.77 47.99,63.23 47.99,51.8 49.26,50.53 U4.1A
N$15
  Bottom 1.27: MOT2.2 47.99,67.04 50.53,64.5 50.53,54.34 51.8,53.07 U4.2A
N$16
  Bottom 1.27: MOT2.3 50.53,70.85 49.26,72.12 44.18,72.12 42.91,70.85 42.91,64.5 45.45,61.96 45.45,49.26 46.72,47.99 U4.1B
N$17
  Bottom 1.27: MOT2.4 53.07,56.88 54.34,55.61 U4.2B
N$18
  Bottom 0.61: RS232.2 U2.14
N$19
  Bottom 0.61: RS232.3 U2.13
N$20
  Bottom 0.61: C9.+ U2.1
N$21
  Bottom 0.61: U2.3 124.19,26.4 122.92,27.67 120.38,27.67 C9.-
N$22
  Bottom 0.61: C10.+ U2.4
N$23
  Bottom 0.61: C10.- U2.5
N$24
  Bottom 0.61: U2.2 126.73,28.94 128,30.21 128,35.93 130.54,38.47 136.89,38.47 138.16,37.2 C11.+
N$25
  Bottom 0.61: C12.- 129.27,34.02 129.27,21.32 126.73,18.78 U2.6
N$26  (via drill 1 pad 1.78)
  Top 0.61: v133.08,9.89 v125.46,9.89
  Bottom 0.61: RS232.4 138.16,14.97 v133.08,9.89 | v125.46,9.89 U2.8
N$27
  Bottom 0.61: U5.CH_PD 78.47,8.62 77.2,7.35 R2.1
N$28
  Bottom 0.61: R4.2 110.85,16.24 T1.2
N$29
  Bottom 0.61: T1.3 106.41,13.7 105.14,14.97 R3.2
N$30
  Bottom 0.61: T1.1 IROUT.1
N$31
  Bottom 0.61: U1.28 26.4,22.59 25.13,23.86 25.13,27.67 21.32,31.48 21.32,37.83 25.13,41.64 25.13,55.61 27.67,58.15 27.67,61.96 26.4,63.23 21.32,63.23 20.27,62.27 20.05,62.05 R15.1 IC3.1
N$32
  Bottom 0.61: T2.1 116.57,64.5 115.3,65.77 D1.A
N$33
  Bottom 0.61: R10.2 111.49,57.52 T2.2
N$34
  Bottom 0.61: T2.3 116.57,58.15 111.49,53.07 R11.2
N$35
  Bottom 0.61: R12.2 22.59,68.31 ENDSTOP.3
N$36
  Bottom 0.61: ENDSTOP.2 18.78,65.77 17.51,64.5 IC3.2
N$37
  Bottom 0.61: R15.2 13.7,60.69 14.97,59.42 IC3.3 12.43,55.61 9.89,55.61 8.62,54.34 R14.1 8.62,47.99 9.89,46.72 R16.S
N$38
  Bottom 0.61: U1.14 69.58,14.97 72.12,17.51 72.12,20.05 73.39,21.32 88.63,21.32 93.71,26.4 110.22,26.4 111.49,25.13 111.49,24.5 R4.1
N$39
  Bottom 0.61: U1.10 54.34,13.7 56.88,11.16 58.15,11.16 Q1.2 C18.1
N$40
  Bottom 0.61: C17.1 Q1.1 54.34,11.16 51.8,13.7 U1.9
N$41
  Bottom 1.27: 12.47,17.47 JP1.PWR 12.43,17.3 12.43,16.24 13.7,14.97 D2.A
RESET  (via drill 1 pad 1.78)
  Top 0.61: v65.77,31.48 v65.77,39.1 | v35.93,33.38 v28.3,33.38 | v29.57,27.04 v29.57,16.24
  Bottom 0.61: ICSP.5 63.23,28.94 v65.77,31.48 | v65.77,39.1 64.5,37.83 50.25,37.83 RESET.3 RESET.4 36.92,37.55 R1.2 v35.93,33.38 | C13.1 30.21,14.33 | 30.21,14.33 30.84,14.33 U1.1 | v28.3,33.38 28.3,28.3 v29.57,27.04 | v29.57,16.24 29.57,14.97 30.21,14.33
RIGHT
  Bottom 0.61: RIGHT.1 RIGHT.2 139.15,53.07 140.7,53.07 141.97,51.8 141.97,45.45 139.43,42.91 124.19,42.91 R7.1 107.68,30.21 105.14,32.75 102.6,32.75 101.33,31.48 101.33,30.21 100.06,28.94 93.71,28.94 87.36,22.59 72.12,22.59 70.85,21.32 70.85,18.78 69.58,17.51 63.23,17.51 61.96,16.24 U1.13
RXD
  Bottom 0.61: U1.4 39.1,17.51 37.83,18.78 28.94,18.78 27.67,17.51 27.67,6.08 28.94,4.81 126.73,4.81 128,6.08 128,17.51 131.81,21.32 U2.12
SCK
  Bottom 0.61: ICSP.3 59.42,26.4 58.15,25.13 58.15,20.05 56.88,18.78 55.61,18.78 54.34,20.05 U1.19
STATUS
  Bottom 0.61: U1.16 61.96,23.86 63.23,25.13 64.5,25.13 67.04,27.67 82.28,27.67 88.63,34.02 94.98,34.02 96.25,35.29 96.25,47.99 97.52,49.26 100.06,49.26 101.33,50.53 101.33,54.34 102.6,55.61 R10.1
STEP1
  Bottom 0.61: U3.STEP 73.39,45.45 72.12,44.18 65.77,44.18 61.96,40.37 35.29,40.37 32.75,37.83 32.75,31.48 39.1,25.13 U1.25
STEP2
  Bottom 0.61: U1.27 34.02,25.77 30.21,29.57 30.21,40.37 34.02,44.18 37.83,44.18 39.1,45.45 U4.STEP
TILTCCW
  Bottom 0.61: TILTCCW.2 TILTCCW.1 125.74,45.45 124.19,45.45 114.03,35.29 R8.1 107.68,35.29 105.14,37.83 101.33,37.83 100.06,36.56 100.06,31.48 98.79,30.21 92.44,30.21 86.09,23.86 70.85,23.86 69.58,22.59 69.58,20.05 68.31,18.78 60.69,18.78 59.42,17.51 U1.12
TILTCW
  Bottom 0.61: TILTCW.2 TILTCW.1 125.74,60.69 124.19,60.69 115.3,51.8 115.3,46.72 114.03,45.45 R6.1 107.68,45.45 105.14,47.99 98.79,47.99 97.52,46.72 97.52,34.02 96.25,32.75 89.9,32.75 83.55,26.4 68.31,26.4 U1.15
TXD
  Bottom 0.61: U2.11 131.81,18.78 129.27,16.24 129.27,4.81 128,3.54 27.67,3.54 26.4,4.81 26.4,18.78 27.67,20.05 40.37,20.05 41.64,18.78 U1.5